# EAGLE schematic 40-auxiliary-suspension (EAGLE 6.6.0)
AUTHOR: Sean Leavey; COMPANY: Institute for Gravitational Research; DATE: 2015-01-19; REVISIONAUTHOR1: Sean Leavey; REVISIONAUTHOR2: Sean Leavey; REVISIONAUTHOR3: Sean Leavey; REVISIONAUTHOR4: Sean Leavey; REVISIONAUTHOR5: Sean Leavey; REVISIONDATE1: 2015-06-30; REVISIONDATE2: 2015-07-14; REVISIONDATE3: 2015-09-19; REVISIONDATE4: 2015-09-28; REVISIONDATE5: 2016-04-06; TITLE: AUX SUSPENSION; TITLE2: WIRING
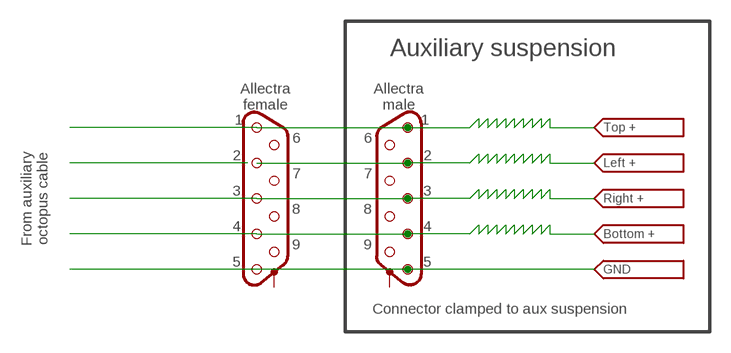
[diagram p0: schematic, sheet 1]
$2 (VS): SPICE: <ignore>
$3 (VS): SPICE: <ignore>
$58 (VS): SPICE: <ignore>
$63 (VS): SPICE: <ignore>
$65 (VS): SPICE: <ignore>

## Parts
X8  XDSUB9-SHIELD  [DUMMY10]
X22  XDSUB9-SHIELD  [DUMMY10]

## Nets
N$3: X8.2 X22.2
N$9: X8.3 X22.3
N$11: X8.1 X22.1
N$65: X8.4 X22.4
N$67: X8.5 X22.5
Unconnected: X8.6 X8.7 X8.8 X8.9 X8.10(S) X22.6 X22.7 X22.8 X22.9 X22.10(S)

## Notes on the sheet
- Auxiliary suspension
- Allectra
  female
- Allectra
  male
- From auxiliary
  octopus cable
- Connector clamped to aux suspension

## Library data of the parts
X8 X22 = symbols:XDSUB9-SHIELD: D-Sub connector, 9 pins, with shield; SPICE: <ignore>